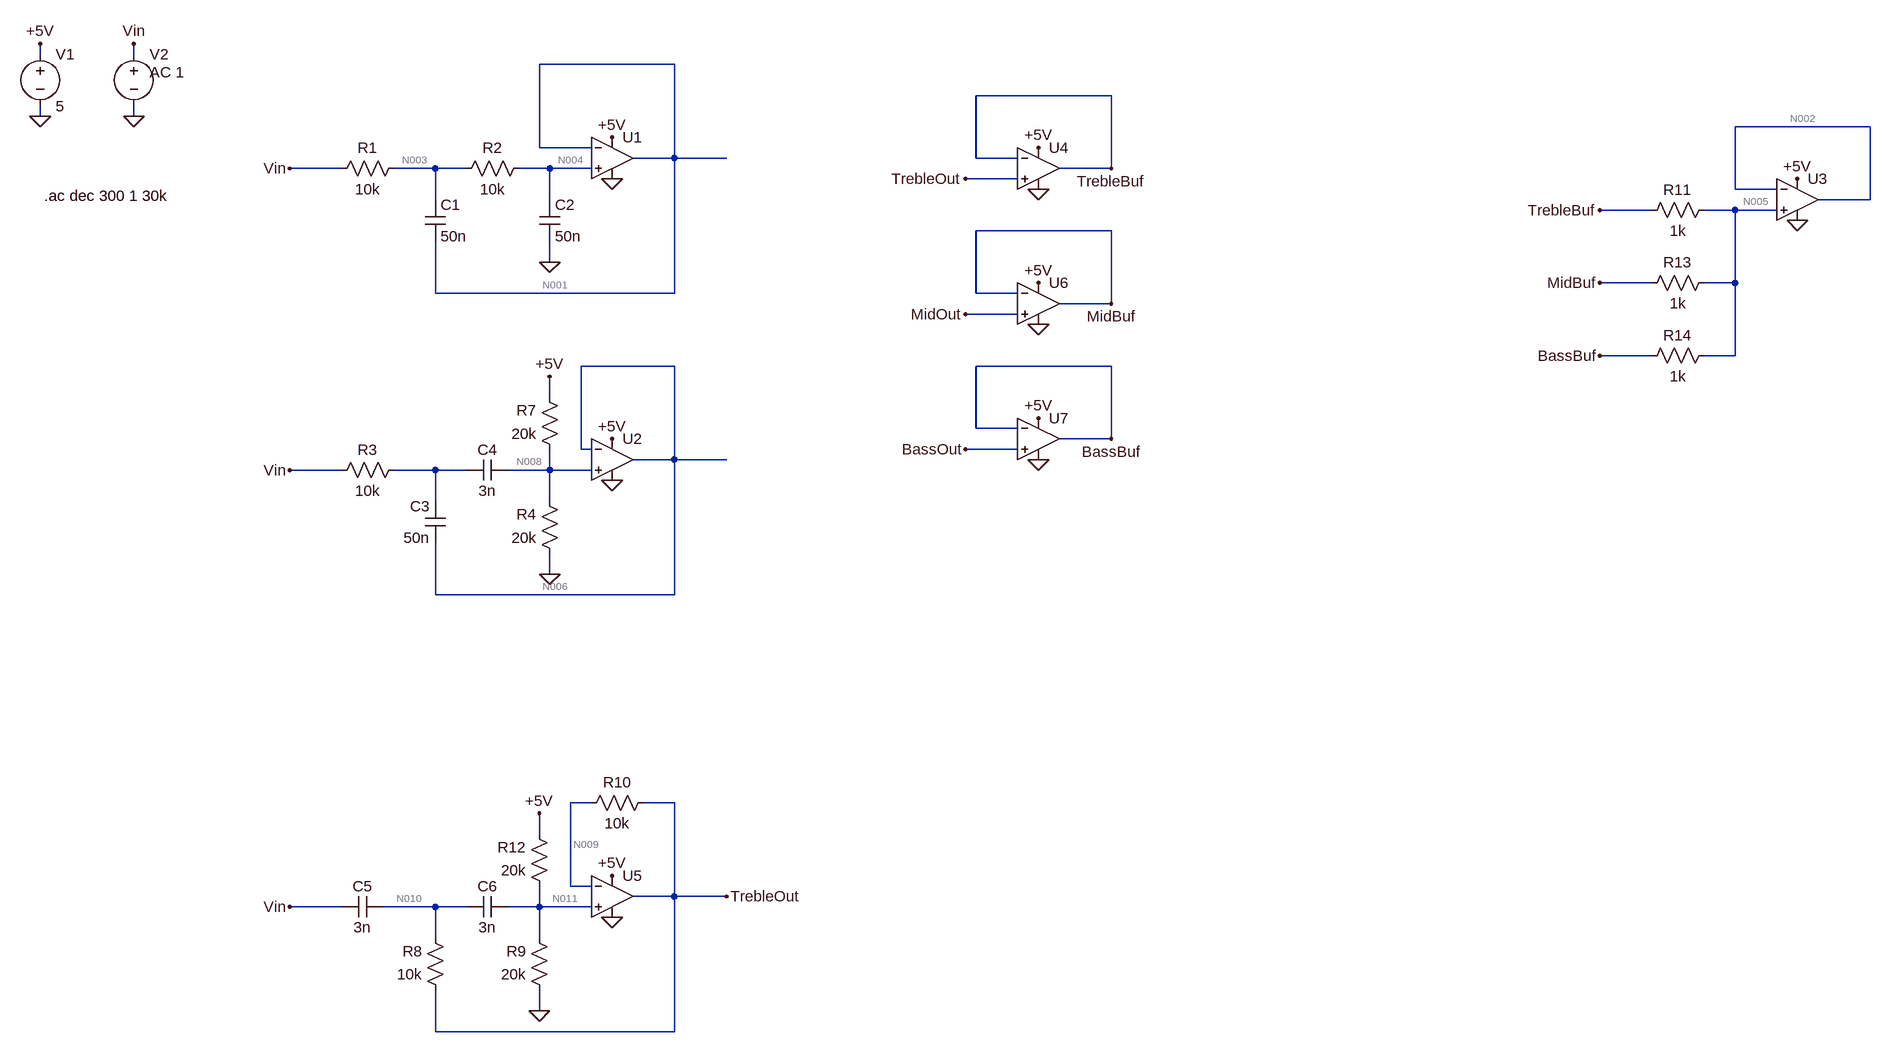
[diagram p0: schematic FiltersBasic.asc]
FiltersBasic.asc, the LTspice schematic file:
Version 4
SHEET 1 2100 1468
WIRE -720 -64 -720 -80
WIRE -576 -64 -576 -80
WIRE 256 -48 48 -48
WIRE 928 0 720 0
WIRE -720 32 -720 16
WIRE -576 32 -576 16
WIRE 2096 48 1888 48
WIRE 48 80 48 -48
WIRE 128 80 48 80
WIRE 256 96 256 -48
WIRE 256 96 192 96
WIRE 336 96 256 96
WIRE 720 96 720 0
WIRE 784 96 720 96
WIRE -256 112 -336 112
WIRE -112 112 -176 112
WIRE -64 112 -112 112
WIRE 64 112 16 112
WIRE 128 112 64 112
WIRE 928 112 928 0
WIRE 928 112 848 112
WIRE 784 128 704 128
WIRE 1888 144 1888 48
WIRE 1952 144 1888 144
WIRE -112 160 -112 112
WIRE 64 160 64 112
WIRE 2096 160 2096 48
WIRE 2096 160 2016 160
WIRE 1760 176 1680 176
WIRE 1888 176 1840 176
WIRE 1952 176 1888 176
WIRE 928 208 720 208
WIRE 64 256 64 224
WIRE 1760 288 1680 288
WIRE 1888 288 1888 176
WIRE 1888 288 1840 288
WIRE -112 304 -112 224
WIRE 256 304 256 96
WIRE 256 304 -112 304
WIRE 720 304 720 208
WIRE 784 304 720 304
WIRE 928 320 928 208
WIRE 928 320 848 320
WIRE 784 336 704 336
WIRE 1760 400 1680 400
WIRE 1888 400 1888 288
WIRE 1888 400 1840 400
WIRE 256 416 112 416
WIRE 928 416 720 416
WIRE 64 464 64 432
WIRE 720 512 720 416
WIRE 784 512 720 512
WIRE 928 528 928 416
WIRE 928 528 848 528
WIRE 112 544 112 416
WIRE 128 544 112 544
WIRE 784 544 704 544
WIRE 256 560 256 416
WIRE 256 560 192 560
WIRE 336 560 256 560
WIRE -256 576 -336 576
WIRE -112 576 -176 576
WIRE -64 576 -112 576
WIRE 64 576 64 544
WIRE 64 576 0 576
WIRE 128 576 64 576
WIRE -112 624 -112 576
WIRE 64 624 64 576
WIRE 64 736 64 704
WIRE -112 768 -112 688
WIRE 256 768 256 560
WIRE 256 768 -112 768
WIRE 128 1088 96 1088
WIRE 256 1088 208 1088
WIRE 48 1136 48 1104
WIRE 96 1216 96 1088
WIRE 128 1216 96 1216
WIRE 256 1232 256 1088
WIRE 256 1232 192 1232
WIRE 336 1232 256 1232
WIRE -256 1248 -336 1248
WIRE -112 1248 -192 1248
WIRE -64 1248 -112 1248
WIRE 48 1248 48 1216
WIRE 48 1248 0 1248
WIRE 128 1248 48 1248
WIRE -112 1296 -112 1248
WIRE 48 1296 48 1248
WIRE 48 1408 48 1376
WIRE -112 1440 -112 1376
WIRE 256 1440 256 1232
WIRE 256 1440 -112 1440
FLAG -576 -80 Vin
FLAG -720 -80 +5V
FLAG -720 32 0
FLAG -576 32 0
FLAG -336 112 Vin
FLAG 64 256 0
FLAG 160 128 0
FLAG 160 64 +5V
FLAG -336 576 Vin
FLAG 64 736 0
FLAG 160 592 0
FLAG 160 528 +5V
FLAG 64 432 +5V
FLAG -336 1248 Vin
FLAG 160 1264 0
FLAG 160 1200 +5V
FLAG 48 1104 +5V
FLAG 48 1408 0
FLAG 336 1232 TrebleOut
FLAG 1680 400 BassBuf
FLAG 1680 288 MidBuf
FLAG 1680 176 TrebleBuf
FLAG 1984 128 +5V
FLAG 1984 192 0
FLAG 816 80 +5V
FLAG 816 144 0
FLAG 816 288 +5V
FLAG 816 352 0
FLAG 816 496 +5V
FLAG 816 560 0
FLAG 704 128 TrebleOut
FLAG 704 336 MidOut
FLAG 704 544 BassOut
FLAG 928 112 TrebleBuf
FLAG 928 320 MidBuf
FLAG 928 528 BassBuf
SYMBOL res -160 96 R90
WINDOW 0 0 56 VBottom 2
WINDOW 3 32 56 VTop 2
SYMATTR InstName R1
SYMATTR Value 10k
SYMBOL res 32 96 R90
WINDOW 0 0 56 VBottom 2
WINDOW 3 32 56 VTop 2
SYMATTR InstName R2
SYMATTR Value 10k
SYMBOL cap -128 160 R0
SYMATTR InstName C1
SYMATTR Value 50n
SYMBOL cap 48 160 R0
SYMATTR InstName C2
SYMATTR Value 50n
SYMBOL voltage -720 -80 R0
WINDOW 123 0 0 Left 0
WINDOW 39 0 0 Left 0
SYMATTR InstName V1
SYMATTR Value 5
SYMBOL voltage -576 -80 R0
WINDOW 123 24 44 Left 2
WINDOW 39 0 0 Left 0
SYMATTR InstName V2
SYMATTR Value ""
SYMATTR Value2 AC 1
SYMBOL OpAmps\\UniversalOpAmp2 160 560 R0
SYMATTR InstName U2
SYMBOL res 80 720 R180
WINDOW 0 36 76 Left 2
WINDOW 3 36 40 Left 2
SYMATTR InstName R4
SYMATTR Value 20k
SYMBOL cap -96 688 R180
WINDOW 0 24 56 Left 2
WINDOW 3 24 8 Left 2
SYMATTR InstName C3
SYMATTR Value 50n
SYMBOL cap 0 560 R90
WINDOW 0 0 32 VBottom 2
WINDOW 3 32 32 VTop 2
SYMATTR InstName C4
SYMATTR Value 3n
SYMBOL res 80 560 R180
WINDOW 0 36 76 Left 2
WINDOW 3 36 40 Left 2
SYMATTR InstName R7
SYMATTR Value 20k
SYMBOL OpAmps\\UniversalOpAmp2 160 1232 R0
SYMATTR InstName U5
SYMBOL res -96 1392 R180
WINDOW 0 36 76 Left 2
WINDOW 3 36 40 Left 2
SYMATTR InstName R8
SYMATTR Value 10k
SYMBOL res 64 1392 R180
WINDOW 0 36 76 Left 2
WINDOW 3 36 40 Left 2
SYMATTR InstName R9
SYMATTR Value 20k
SYMBOL cap -192 1232 R90
WINDOW 0 0 32 VBottom 2
WINDOW 3 32 32 VTop 2
SYMATTR InstName C5
SYMATTR Value 3n
SYMBOL cap 0 1232 R90
WINDOW 0 0 32 VBottom 2
WINDOW 3 32 32 VTop 2
SYMATTR InstName C6
SYMATTR Value 3n
SYMBOL res 224 1072 R90
WINDOW 0 0 56 VBottom 2
WINDOW 3 32 56 VTop 2
SYMATTR InstName R10
SYMATTR Value 10k
SYMBOL res 64 1232 R180
WINDOW 0 36 76 Left 2
WINDOW 3 36 40 Left 2
SYMATTR InstName R12
SYMATTR Value 20k
SYMBOL OpAmps\\UniversalOpAmp2 1984 160 R0
SYMATTR InstName U3
SYMBOL res 1856 160 R90
WINDOW 0 0 56 VBottom 2
WINDOW 3 32 56 VTop 2
SYMATTR InstName R11
SYMATTR Value 1k
SYMBOL res 1856 272 R90
WINDOW 0 0 56 VBottom 2
WINDOW 3 32 56 VTop 2
SYMATTR InstName R13
SYMATTR Value 1k
SYMBOL res 1856 384 R90
WINDOW 0 0 56 VBottom 2
WINDOW 3 32 56 VTop 2
SYMATTR InstName R14
SYMATTR Value 1k
SYMBOL OpAmps\\UniversalOpAmp2 816 112 R0
SYMATTR InstName U4
SYMBOL OpAmps\\UniversalOpAmp2 816 320 R0
SYMATTR InstName U6
SYMBOL OpAmps\\UniversalOpAmp2 816 528 R0
SYMATTR InstName U7
SYMBOL OpAmps\\UniversalOpAmp 160 96 R0
SYMATTR InstName U1
SYMBOL res -160 560 R90
WINDOW 0 0 56 VBottom 2
WINDOW 3 32 56 VTop 2
SYMATTR InstName R3
SYMATTR Value 10k
TEXT -714 154 Left 2 !.ac dec 300 1 30k

The netlist it stands for:
* FiltersBasic.asc
R1 N003 Vin 10k
R2 N004 N003 10k
C1 N003 N001 50n
C2 N004 0 50n
V1 +5V 0 5
V2 Vin 0 AC 1
XU2 N008 N006 +5V 0 N006 level2 Avol=1Meg GBW=10Meg Slew=10Meg Ilimit=25m Rail=0 Vos=0 En=0 Enk=0 In=0 Ink=0 Rin=500Meg  ; pins In+ In- V+ V- OUT
R4 0 N008 20k
C3 N006 N007 50n
C4 N008 N007 3n
R7 N008 +5V 20k
XU5 N011 N009 +5V 0 TrebleOut level2 Avol=1Meg GBW=10Meg Slew=10Meg Ilimit=25m Rail=0 Vos=0 En=0 Enk=0 In=0 Ink=0 Rin=500Meg  ; pins In+ In- V+ V- OUT
R8 TrebleOut N010 10k
R9 0 N011 20k
C5 N010 Vin 3n
C6 N011 N010 3n
R10 TrebleOut N009 10k
R12 N011 +5V 20k
XU3 N005 N002 +5V 0 N002 level2 Avol=1Meg GBW=10Meg Slew=10Meg Ilimit=25m Rail=0 Vos=0 En=0 Enk=0 In=0 Ink=0 Rin=500Meg  ; pins In+ In- V+ V- OUT
R11 N005 TrebleBuf 1k
R13 N005 MidBuf 1k
R14 N005 BassBuf 1k
XU4 TrebleOut TrebleBuf +5V 0 TrebleBuf level2 Avol=1Meg GBW=10Meg Slew=10Meg Ilimit=25m Rail=0 Vos=0 En=0 Enk=0 In=0 Ink=0 Rin=500Meg  ; pins In+ In- V+ V- OUT
XU6 MidOut MidBuf +5V 0 MidBuf level2 Avol=1Meg GBW=10Meg Slew=10Meg Ilimit=25m Rail=0 Vos=0 En=0 Enk=0 In=0 Ink=0 Rin=500Meg  ; pins In+ In- V+ V- OUT
XU7 BassOut BassBuf +5V 0 BassBuf level2 Avol=1Meg GBW=10Meg Slew=10Meg Ilimit=25m Rail=0 Vos=0 En=0 Enk=0 In=0 Ink=0 Rin=500Meg  ; pins In+ In- V+ V- OUT
XU1 N004 N001 +5V 0 N001 level1 Avol=1Meg GBW=10Meg Vos=0 En=0 Enk=0 In=0 Ink=0 Rin=500Meg  ; pins In+ In- V+ V- OUT
R3 N007 Vin 10k
.ac dec 300 1 30k
.lib UniversalOpAmp2.lib
.lib UniversalOpAmp1.lib
.backanno
.end

* Results of the author's LTspice run, read from the files saved beside the schematic
* Operating Point, zero values left out:
*   V(n003) = 50 µV
*   V(n004) = 100 µV
*   V(n001) = 100 µV
*   V(+5v) = 5 V
*   V(n006) = 2.5 V
*   V(n008) = 2.5 V
*   V(trebleout) = 2.5 V
*   V(n009) = 2.5 V
*   V(n011) = 2.5 V
*   V(n010) = 2.5 V
*   V(n002) = 2.5 V
*   V(n005) = 2.5 V
*   V(treblebuf) = 2.5 V
*   V(midbuf) = 2.5 V
*   V(bassbuf) = 2.5 V
*   V(midout) = 2.5 V
*   V(bassout) = 2.5 V
*   I(R1) = 5 nA
*   I(R2) = 5 nA
*   I(R4) = -125 µA
*   I(R7) = -125 µA
*   I(R9) = -125 µA
*   I(R12) = -125 µA
*   I(V1) = -1.75 mA
*   I(V2) = 5 nA
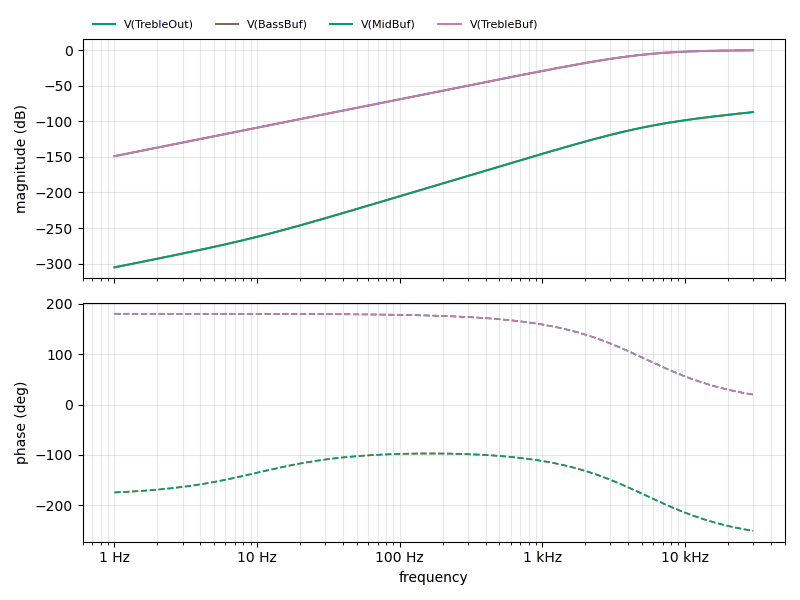
[diagram p1: AC Analysis of FiltersBasic.asc, plotted from the saved traces]
* AC Analysis, 1 run:
*   V(TrebleOut): -148.99 dB at 1 Hz, -0.27 dB at 30 kHz, peak -0.27 dB at 30 kHz, 3 dB below the peak at 7.831 kHz
*   V(BassBuf): -305.33 dB at 1 Hz, -87.11 dB at 30 kHz, peak -87.11 dB at 30 kHz, 3 dB below the peak at 21.79 kHz
*   V(MidBuf): -305.33 dB at 1 Hz, -87.11 dB at 30 kHz, peak -87.11 dB at 30 kHz, 3 dB below the peak at 21.79 kHz
*   V(TrebleBuf): -148.99 dB at 1 Hz, -0.27 dB at 30 kHz, peak -0.27 dB at 30 kHz, 3 dB below the peak at 7.831 kHz